# EAGLE design usbuc (EAGLE 8.6.2)
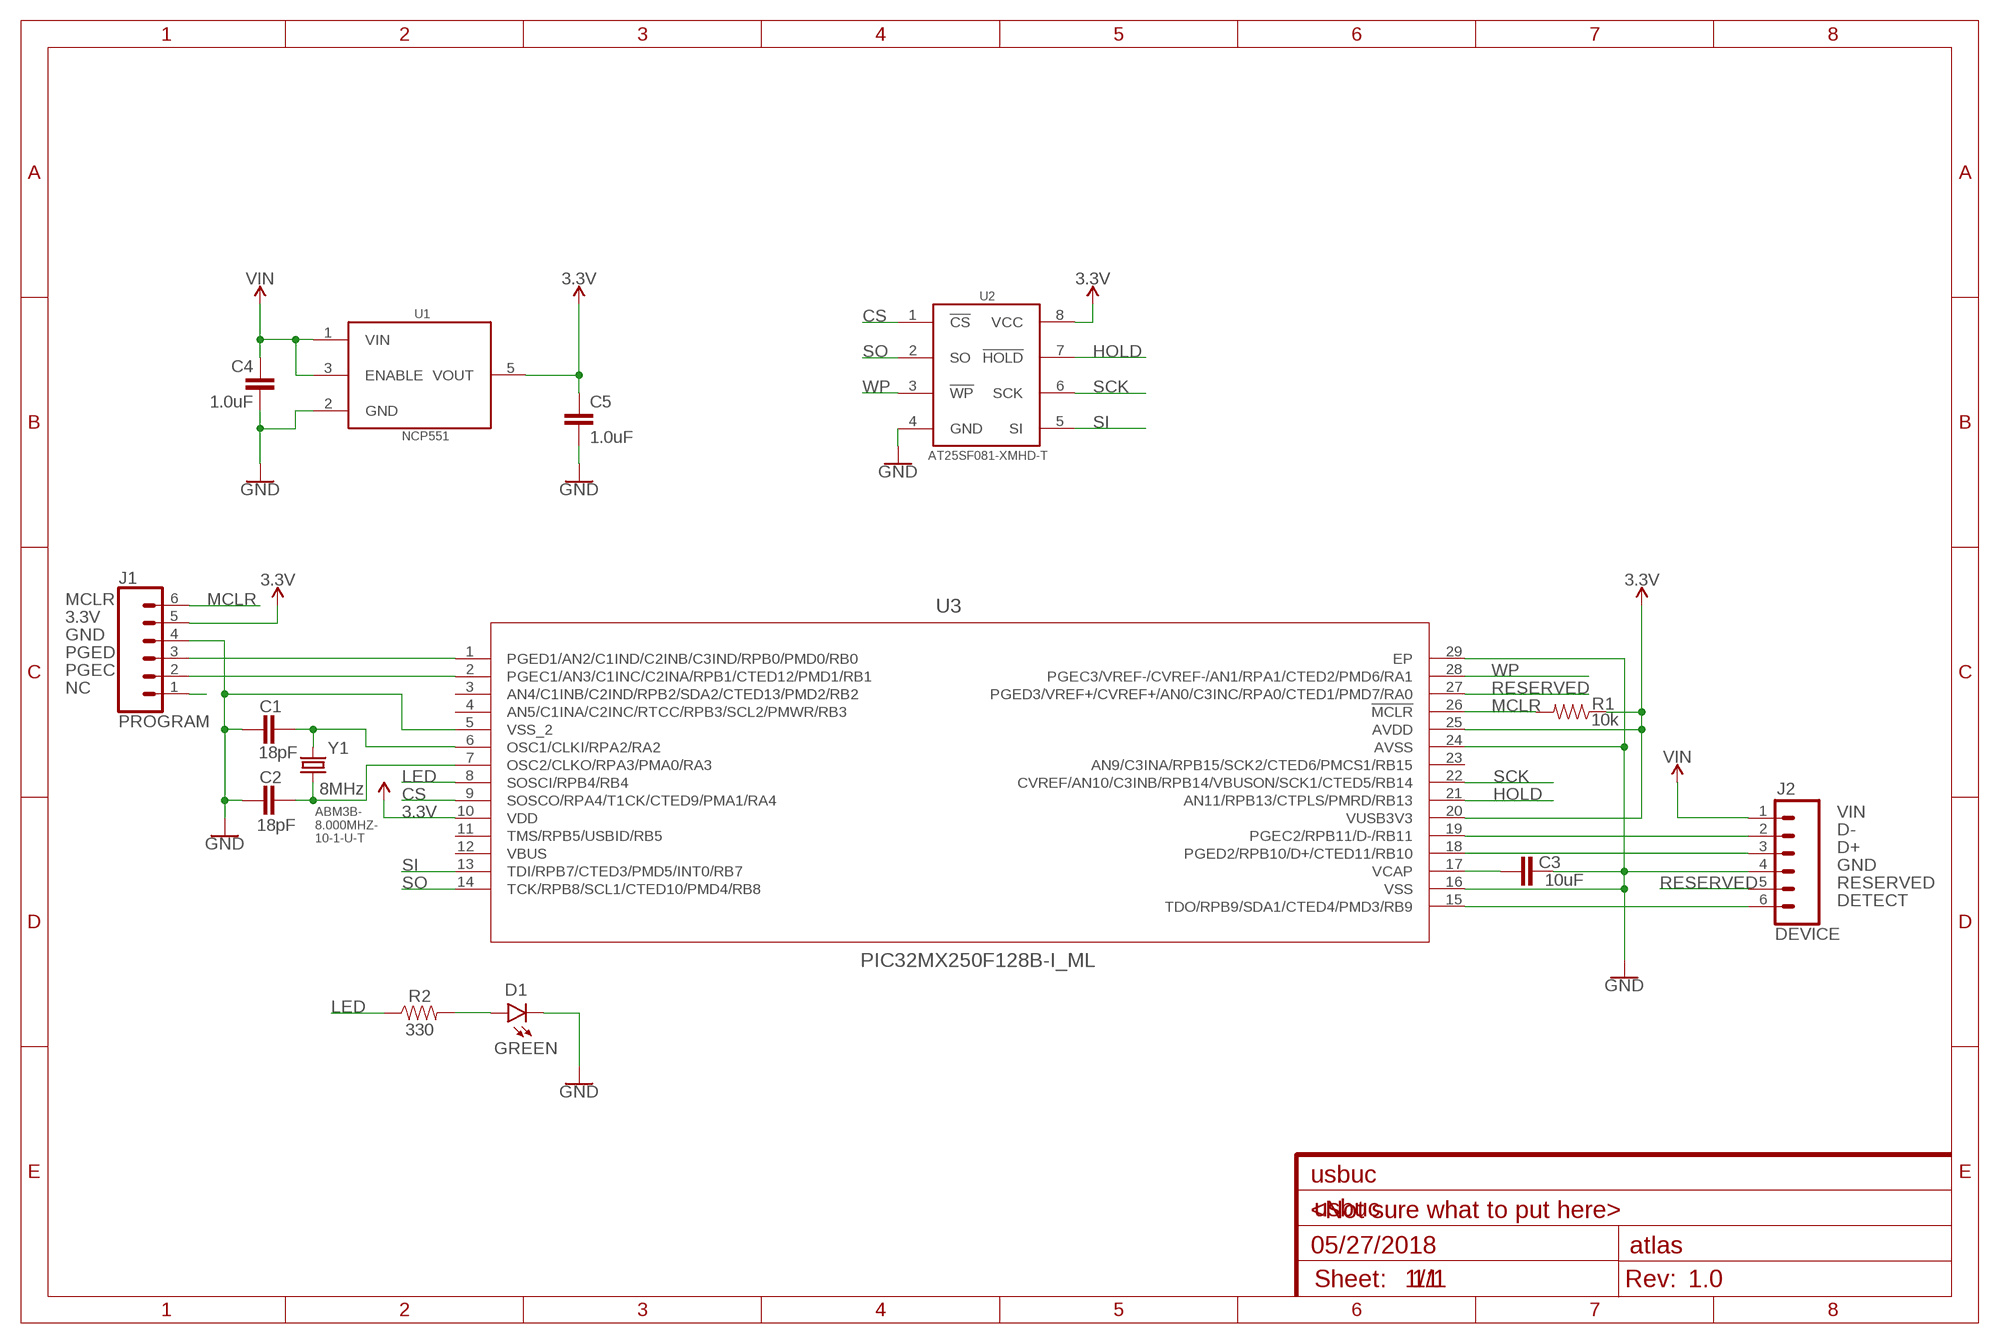
[diagram p0: schematic, sheet 1]

## Parts
C1  18pF  18PF-0603-50V-5%  [0603]
C2  18pF  18PF-0603-50V-5%  [0603]
C3  10uF  10UF-0603-6.3V-20%  [0603]
C4  1.0uF  1.0UF-0603-16V-10%  [0603]
C5  1.0uF  1.0UF-0603-16V-10%  [0603]
D1  GREEN  LED-GREEN0603  [LED-0603]
J1  PROGRAM  CONN_06FEMALE_LOCK  [1X06_FEMALE_LOCK.010]
J2  DEVICE  CONN_06LONGPADS  [1X06_LONGPADS]
R1  10k  10KOHM-0603-1/10W-1%  [0603]
R2  330  330OHM-0603-1/10W-1%  [0603]
U1  NCP551  [TSOP-5]
U2  AT25SF081-XMHD-T  [TSSOP8]
U3  PIC32MX250F128B-I_ML  [QFN28_6X6MC]
Y1  8MHz  CRYSTAL-8MHZSMD-5X3.2  [CRYSTAL-SMD-5X3.2-4PAD]

## Nets
3.3V: C5.1 J1.5 R1.1 U1.5(VOUT) U2.8(VCC) U3.10(VDD) U3.20(VUSB3V3) U3.25(AVDD)
CS: U2.1(!CS) U3.9(SOSCO/RPA4/T1CK/CTED9/PMA1/RA4)
D+: J2.3 U3.18(PGED2/RPB10/D+/CTED11/RB10)
D-: J2.2 U3.19(PGEC2/RPB11/D-/RB11)
DETECT: J2.6 U3.15(TDO/RPB9/SDA1/CTED4/PMD3/RB9)
GND: C1.1 C2.1 C3.2 C4.2 C5.2 D1.C J1.4 J2.4 U1.2(GND) U2.4(GND) U3.5(VSS_2) U3.16(VSS) U3.24(AVSS) U3.29(EP)
HOLD: U2.7(!HOLD) U3.21(AN11/RPB13/CTPLS/PMRD/RB13)
LED: R2.1 U3.8(SOSCI/RPB4/RB4)
MCLR: J1.6 R1.2 U3.26(!MCLR)
N$1: D1.A R2.2
N$5: C1.2 U3.6(OSC1/CLKI/RPA2/RA2) Y1.3
N$6: C2.2 U3.7(OSC2/CLKO/RPA3/PMA0/RA3) Y1.1
N$7: C3.1 U3.17(VCAP)
NC: J1.1
PGEC: J1.2 U3.2(PGEC1/AN3/C1INC/C2INA/RPB1/CTED12/PMD1/RB1)
PGED: J1.3 U3.1(PGED1/AN2/C1IND/C2INB/C3IND/RPB0/PMD0/RB0)
RESERVED: J2.5 U3.27(PGED3/VREF+/CVREF+/AN0/C3INC/RPA0/CTED1/PMD7/RA0)
SCK: U2.6(SCK) U3.22(CVREF/AN10/C3INB/RPB14/VBUSON/SCK1/CTED5/RB14)
SI: U2.5(SI) U3.13(TDI/RPB7/CTED3/PMD5/INT0/RB7)
SO: U2.2(SO) U3.14(TCK/RPB8/SCL1/CTED10/PMD4/RB8)
VIN: C4.1 J2.1 U1.1(VIN) U1.3(ENABLE)
WP: U2.3(!WP) U3.28(PGEC3/VREF-/CVREF-/AN1/RPA1/CTED2/PMD6/RA1)
Unconnected: U3.3(AN4/C1INB/C2IND/RPB2/SDA2/CTED13/PMD2/RB2) U3.4(AN5/C1INA/C2INC/RTCC/RPB3/SCL2/PMWR/RB3) U3.11(TMS/RPB5/USBID/RB5) U3.23(AN9/C3INA/RPB15/SCK2/CTED6/PMCS1/RB15)

## Notes on the sheet
- ABM3B-
  8.000MHZ-
  10-1-U-T
- usbuc
- <Not sure what to put here>
- 05/27/2018 | atlas
- 1/1 | 1.0

## Power pins joined to a net without a drawn wire
VBUS: U3.12(VBUS)

## Library data of the parts
C1 C2 = SparkFun-Capacitors:18PF: 18pF ceramic capacitors A capacitor is a passive two-terminal electrical component used to store electrical energy temporarily in an electric field.; PROD_ID: CAP-08267
C3 = SparkFun-Capacitors:10UF: 10.0µF ceramic capacitors A capacitor is a passive two-terminal electrical component used to store electrical energy temporarily in an electric field.; PROD_ID: CAP-11015
C4 C5 = SparkFun-Capacitors:1.0UF: 1µF ceramic capacitors A capacitor is a passive two-terminal electrical component used to store electrical energy temporarily in an electric field.; PROD_ID: CAP-00868
D1 = SparkFun-LED:LED-GREEN: Green SMD LED Used in manufacturing of various products at SparkFun Packages: 0603 - SMD 0603 package [Product Link] <http://www.futureelectronics.com/en/technologies/semiconductors/optoelectronics/leds/Pages/9894312-LTST-C190GKT.aspx?CrossPart=HSMG-C190&IM=0> LilyPad 1206 - SMD1206 LilyPad package [Product Link] <http://www.futureelectronics.com/en/Technologies/Product.aspx?ProductID=IN150NGHARVATEKCORPORATION2049943&IM=0> 1206 - SMD1206 package [Product Link] <http://www.futureelectronics.com/en/technologies/semiconductors/optoelectronics/leds/Pages/8315665-LTST-C150KGKT.aspx?IM=0> 1206 Bottom Mount -SMD 1206 Bottom Mount [Product Link] <http://www.digikey.com/product-detail/en/lite-on-inc/LTST-C230KGKT/160-1456-1-ND/386854> SparkFun Products: Pro Mini 328 -5V <https://www.sparkfun.com/products/821> RedBoard <https://www.sparkfun.com/products/12757> MP3 Trigger <https://www.sparkfun.com/products/13720> Makey Makey <https://www.sparkfun.com/products/11076>; PROD_ID: DIO-00821
J1 J2 = SparkFun-Connectors:CONN_06: Multi connection point. Often used as Generic Header-pin footprint for 0.1 inch spaced/style header connections On any of the 0.1 inch spaced packages, you can populate with these: Break Away Headers - Straight <https://www.sparkfun.com/products/116> (PRT-00116) Break Away Male Headers - Right Angle <https://www.sparkfun.com/products/553> (PRT-00553) Female Headers <https://www.sparkfun.com/products/115> (PRT-00115) Break Away Headers - Machine Pin <https://www.sparkfun.com/products/117> (PRT-00117) Break Away Female Headers - Swiss Machine Pin <https://www.sparkfun.com/products/743> (PRT-00743) Arduino Stackable Header - 6 Pin <https://www.sparkfun.com/products/9280> (PRT-09280) For SCREWTERMINALS and SPRING TERMINALS visit here: Screw Terimnals on SparkFun.com <https://www.sparkfun.com/search/results?term=Screw+Terminals> (5mm/3.5mm/2.54mm spacing) This device is also useful as a general connection point to wire up your design to another part of your project. Our various solder wires solder well into these plated through hole pads. Hook-Up Wire - Assortment (Stranded, 22 AWG) <https://www.sparkfun.com/products/11375> (PRT-11375) Hook-Up Wire - Assortment (Solid Core, 22 AWG) <https://www.sparkfun.com/products/11367> (PRT-11367) View the entire wire category on our website here <https://www.sparkfun.com/categories/141>
R1 = SparkFun-Resistors:10KOHM: 10kΩ resistor A resistor is a passive two-terminal electrical component that implements electrical resistance as a circuit element. Resistors act to reduce current flow, and, at the same time, act to lower voltage levels within circuits. - Wikipedia; PROD_ID: RES-00824
R2 = SparkFun-Resistors:330OHM: 330Ω resistor A resistor is a passive two-terminal electrical component that implements electrical resistance as a circuit element. Resistors act to reduce current flow, and, at the same time, act to lower voltage levels within circuits. - Wikipedia; PROD_ID: RES-00818
U1 = usbuc:NCP551
U2 = usbuc:AT25SF081-XMHD-T
U3 = usbuc:PIC32MX250F128B-I_ML
Y1 = SparkFun-Clocks:CRYSTAL-8MHZ: 8MHz Crystal Datasheet Example <http://www.futureelectronics.com/en/technologies/electromechanical/timing-devices/crystals/Pages/6008189-ABM3B-8.000MHZ-B2-T.aspx?IM=0> Frequency: 8MHz Frequency Tolerance: ±20ppm Load Capacitance: 18pF SparkFun Products: Pro Micro -3.3V/8MHz <https://www.sparkfun.com/products/12587> WAV Trigger <https://www.sparkfun.com/products/13660>; PROD_ID: XTAL-09431

## Board
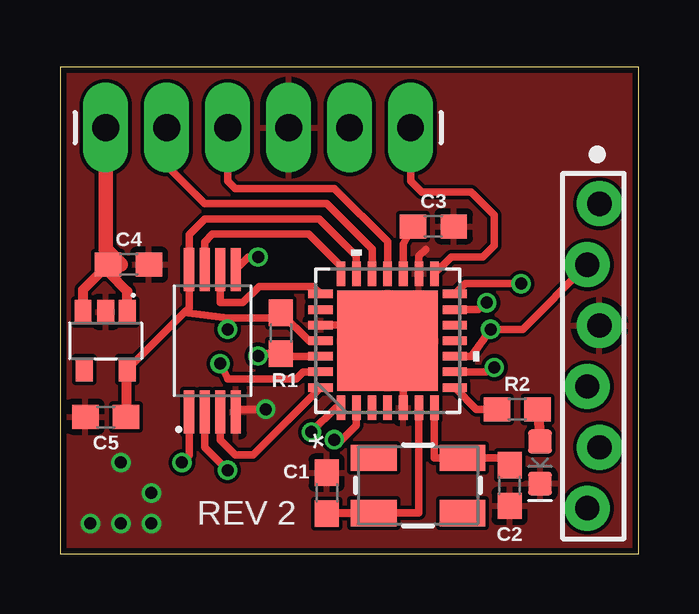
[diagram p1: board, top side]
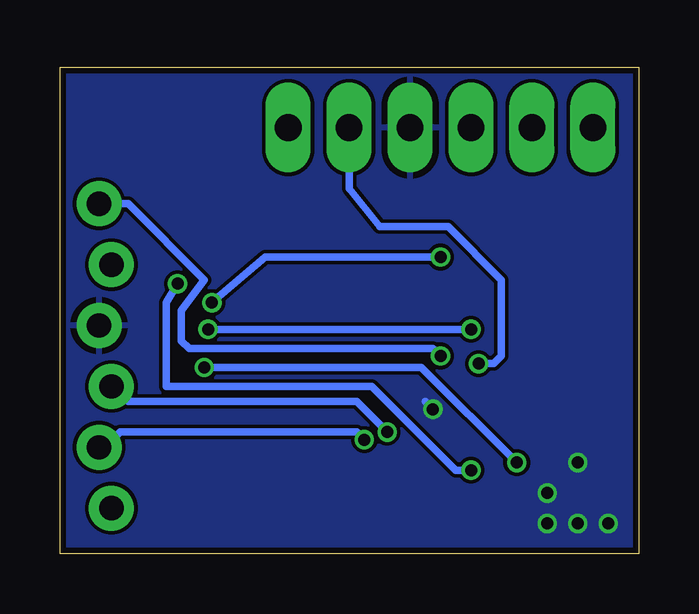
[diagram p2: board, bottom side, seen from below]

Size 24.11 x 20.31 mm. Coordinates in mm from the lower left corner, seen from the top.
Outline: 0,0 24.11,0 24.11,20.31 0,20.31 0,0
Copper layers (1*16): Top 0.035mm / dielectric 1.5mm / Bottom 0.035mm
Design rules "ITead_rule": minimum track width 6mil, minimum drill 12mil, track to track 6mil, track to pad 6mil, pad to pad 6mil, via to via 6mil, smd to smd 0mil, copper to edge 10mil, drill to drill 10mil, minimum pad ring 10mil, minimum via ring 6mil, stop-mask expansion 2mil, vias tented up to drill 100mil, thermal gap 10mil

### Footprints (pad centres in the part's own frame; a part is rotated, then mirrored left to right if it is on the bottom)
0603 = smd 1.1 x 1: 1 -0.85,0; 2 0.85,0
LED-0603 = smd 1 x 1: A -0.877,0; C 0.877,0
1X06_FEMALE_LOCK.010 = drill 1.016 pad 1.88: 1 0,0.254; 2 2.54,-0.254; 3 5.08,0.254; 4 7.62,-0.254; 5 10.16,0.254; 6 12.7,-0.254
1X06_LONGPADS = drill 1.118 pad 1.88 long: 1 0,0; 2 2.54,0; 3 5.08,0; 4 7.62,0; 5 10.16,0; 6 12.7,0
TSOP-5 = smd 0.7 x 1: 1 0.9,1.2; 2 0,1.2; 3 -0.95,1.2; 4 -0.9,-1.2; 5 0.9,-1.2
TSSOP8 = smd 0.42 x 1.78: 1 -0.975,-2.97; 2 -0.325,-2.97; 3 0.325,-2.97; 4 0.975,-2.97; 5 0.975,2.97; 6 0.325,2.97; 7 -0.325,2.97; 8 -0.975,2.97
QFN28_6X6MC = smd 1.016 x 0.356: 1 -2.794,1.95; 2 -2.794,1.3; 3 -2.794,0.65; 4 -2.794,0; 5 -2.794,-0.65; 6 -2.794,-1.3; 7 -2.794,-1.95; 15 2.794,-1.95; 16 2.794,-1.3; 17 2.794,-0.65; 18 2.794,0; 19 2.794,0.65; 20 2.794,1.3; 21 2.794,1.95 | smd 0.356 x 1.016: 8 -1.95,-2.794; 9 -1.3,-2.794; 10 -0.65,-2.794; 11 0,-2.794; 12 0.65,-2.794; 13 1.3,-2.794; 14 1.95,-2.794; 22 1.95,2.794; 23 1.3,2.794; 24 0.65,2.794; 25 0,2.794; 26 -0.65,2.794; 27 -1.3,2.794; 28 -1.95,2.794 | smd 4.191 x 4.191: 29 0,0
CRYSTAL-SMD-5X3.2-4PAD = smd 1.9 x 1.1: 1 -1.85,-1.15; 2 1.85,-1.15; 3 1.85,1.15; 4 -1.85,1.15

### Placement (x,y rotation side)
C1  11.11,2.54 270 top
C2  18.73,2.86 90 top
C3  15.56,13.65 0 top
C4  2.86,12.06 0 top
C5  1.91,5.71 180 top
D1  20,3.81 270 top
FRAME1  FRAME-A4L  [DUMMY]  0,0 0 top
J1  22.23,1.91 90 top
J2  1.91,17.78 0 top
R1  9.21,9.21 270 top
R2  19.05,6.03 0 top
U1  1.91,8.89 0 top
U2  6.35,8.89 0 top
U3  13.65,8.89 90 top
Y1  14.92,2.86 180 top

### Tracks (layer width: path | path; a pad name or v marks a point on that pad's centre or on a via)
3.3V  (via drill 0.5)
  Top 0.305: J1.5 19.27,9.37 v17.94,9.37 17.13,8.24 U3.10 | U1.5 5.18,10.06 | 5.18,10.06 5.38,10.26 U2.8 5.38,13.31 6.03,13.97 10.79,13.97 12.35,12.41 U3.20 | 5.18,10.06 6.99,9.84 | 6.99,9.84 v6.99,9.37 | 6.99,9.84 8.99,9.84 R1.1 10.38,8.89 U3.25
  Top 0.406: U1.5 2.75,7.64 C5.1
  Bottom 0.305: v6.99,9.37 v17.94,9.37
CS  (via drill 0.5)
  Top 0.305: U2.1 5.38,4.11 v5.08,3.81 | v18.1,7.78 17.75,7.59 U3.9
  Bottom 0.305: v5.08,3.81 9.05,7.78 v18.1,7.78
D+
  Top 0.305: J2.3 6.99,15.56 7.3,15.24 11.43,15.24 13.65,13.02 U3.18
D-
  Top 0.305: U3.19 13,12.71 11.11,14.61 6.03,14.61 4.45,16.19 J2.2
DETECT
  Top 0.305: U3.15 16.3,12.38 17.62,12.38 18.1,12.86 18.1,14.13 17.14,15.08 15.08,15.08 14.61,15.56 J2.6
GND  (via drill 0.5)
  Top 0.305: U3.5 14.3,8.56 13.97,8.89 | U3.24 13.32,9.54 13.97,8.89 | 13.97,8.89 U3.29 | U3.16 14.95,12.41 15.24,12.7 | U2.4 7.44,6.03 v8.57,6.03
  Bottom 0.305: v8.57,6.03 8.89,6.35
  other vias: 2.54,3.81 3.81,2.54 3.81,1.27 2.54,1.27 1.27,1.27
  pour Top: -1.27,21.59 25.4,21.59 25.4,-1.27 -1.27,-1.27
  pour Bottom: -2.54,22.86 26.67,22.86 26.67,-2.54 -2.54,-2.54
HOLD
  Top 0.305: U2.7 6.03,13.01 6.35,13.34 10.37,13.34 11.7,12 U3.21
LED
  Top 0.305: U3.8 17.35,6.03 R2.1
MCLR  (via drill 0.5)
  Top 0.305: U3.26 9.41,8.24 R1.2 8.36,8.36 v8.26,8.26
  Bottom 0.305: v8.26,8.26 8.57,8.57 18.73,8.57 19.05,8.89 19.05,10.16 18.1,11.43 21.27,14.61 J1.6
N$1
  Top 0.406: R2.2 D1.A
N$5
  Top 0.305: U3.6 14.95,1.71 Y1.3 11.43,1.71 C1.2 13.02,1.69 13.02,1.75
N$6
  Top 0.305: Y1.1 15.6,4.01 U3.7 | Y1.1 18.41,4.01 C2.2 | Y1.1 19.05,4.01 19.05,3.81
N$7
  Top 0.305: C3.1 14.3,12.93 U3.17
PGEC  (via drill 0.5)
  Top 0.305: U3.2 12.35,5.37 11.75,4.76 v11.43,4.76
  Bottom 0.305: J1.2 22.23,4.45 21.59,5.08 11.75,5.08 v11.43,4.76
PGED  (via drill 0.5)
  Top 0.305: U3.1 11.49,6.1 v10.48,5.08
  Bottom 0.305: v10.48,5.08 11.75,6.35 21.27,6.35 21.91,6.99 J1.3
RESERVED  (via drill 0.5)
  Top 0.305: U3.27 10.13,7.59 9.84,7.3 6.99,7.3 v6.67,7.94
  Bottom 0.305: v6.67,7.94 6.03,7.94 5.71,8.26 5.71,11.43 7.94,13.65 10.79,13.65 12.06,15.24 J2.5
SCK
  Top 0.305: U2.6 6.67,10.48 7.62,10.48 8.3,11.16 10.54,11.16 U3.22
SI  (via drill 0.5)
  Top 0.305: U2.5 7.85,12.38 v8.26,12.38 | v17.78,10.48 17.43,10.19 U3.13
  Bottom 0.305: v8.26,12.38 15.56,12.38 v17.78,10.48
SO  (via drill 0.5)
  Top 0.305: v19.21,11.27 16.88,11.27 U3.14 | v6.99,3.49 6.03,4.45 U2.2
  Bottom 0.305: v6.99,3.49 7.62,3.49 11.11,6.99 19.68,6.99 19.68,10.48 v19.21,11.27
VIN
  Top 0.406: U1.1 2.81,10.95 2.01,11.75 C4.1 | U1.3 0.95,11.01 C4.1 | C4.1 2.01,12.17 2.22,12.38
  Top 0.61: 2.54,12.06 2.22,12.38 1.91,12.7 J2.1
WP
  Top 0.305: U3.28 8.05,4.13 7.3,4.13 6.67,4.75 U2.3

### Text on the board
tPlace: REV 2